# EAGLE schematic MicroBrute Noise add-on (EAGLE 7.5.0)
CNAME: Microbrute Addon; CREVISION: 1; DESIGNER: Gilberte / Mads Kjeldgaard
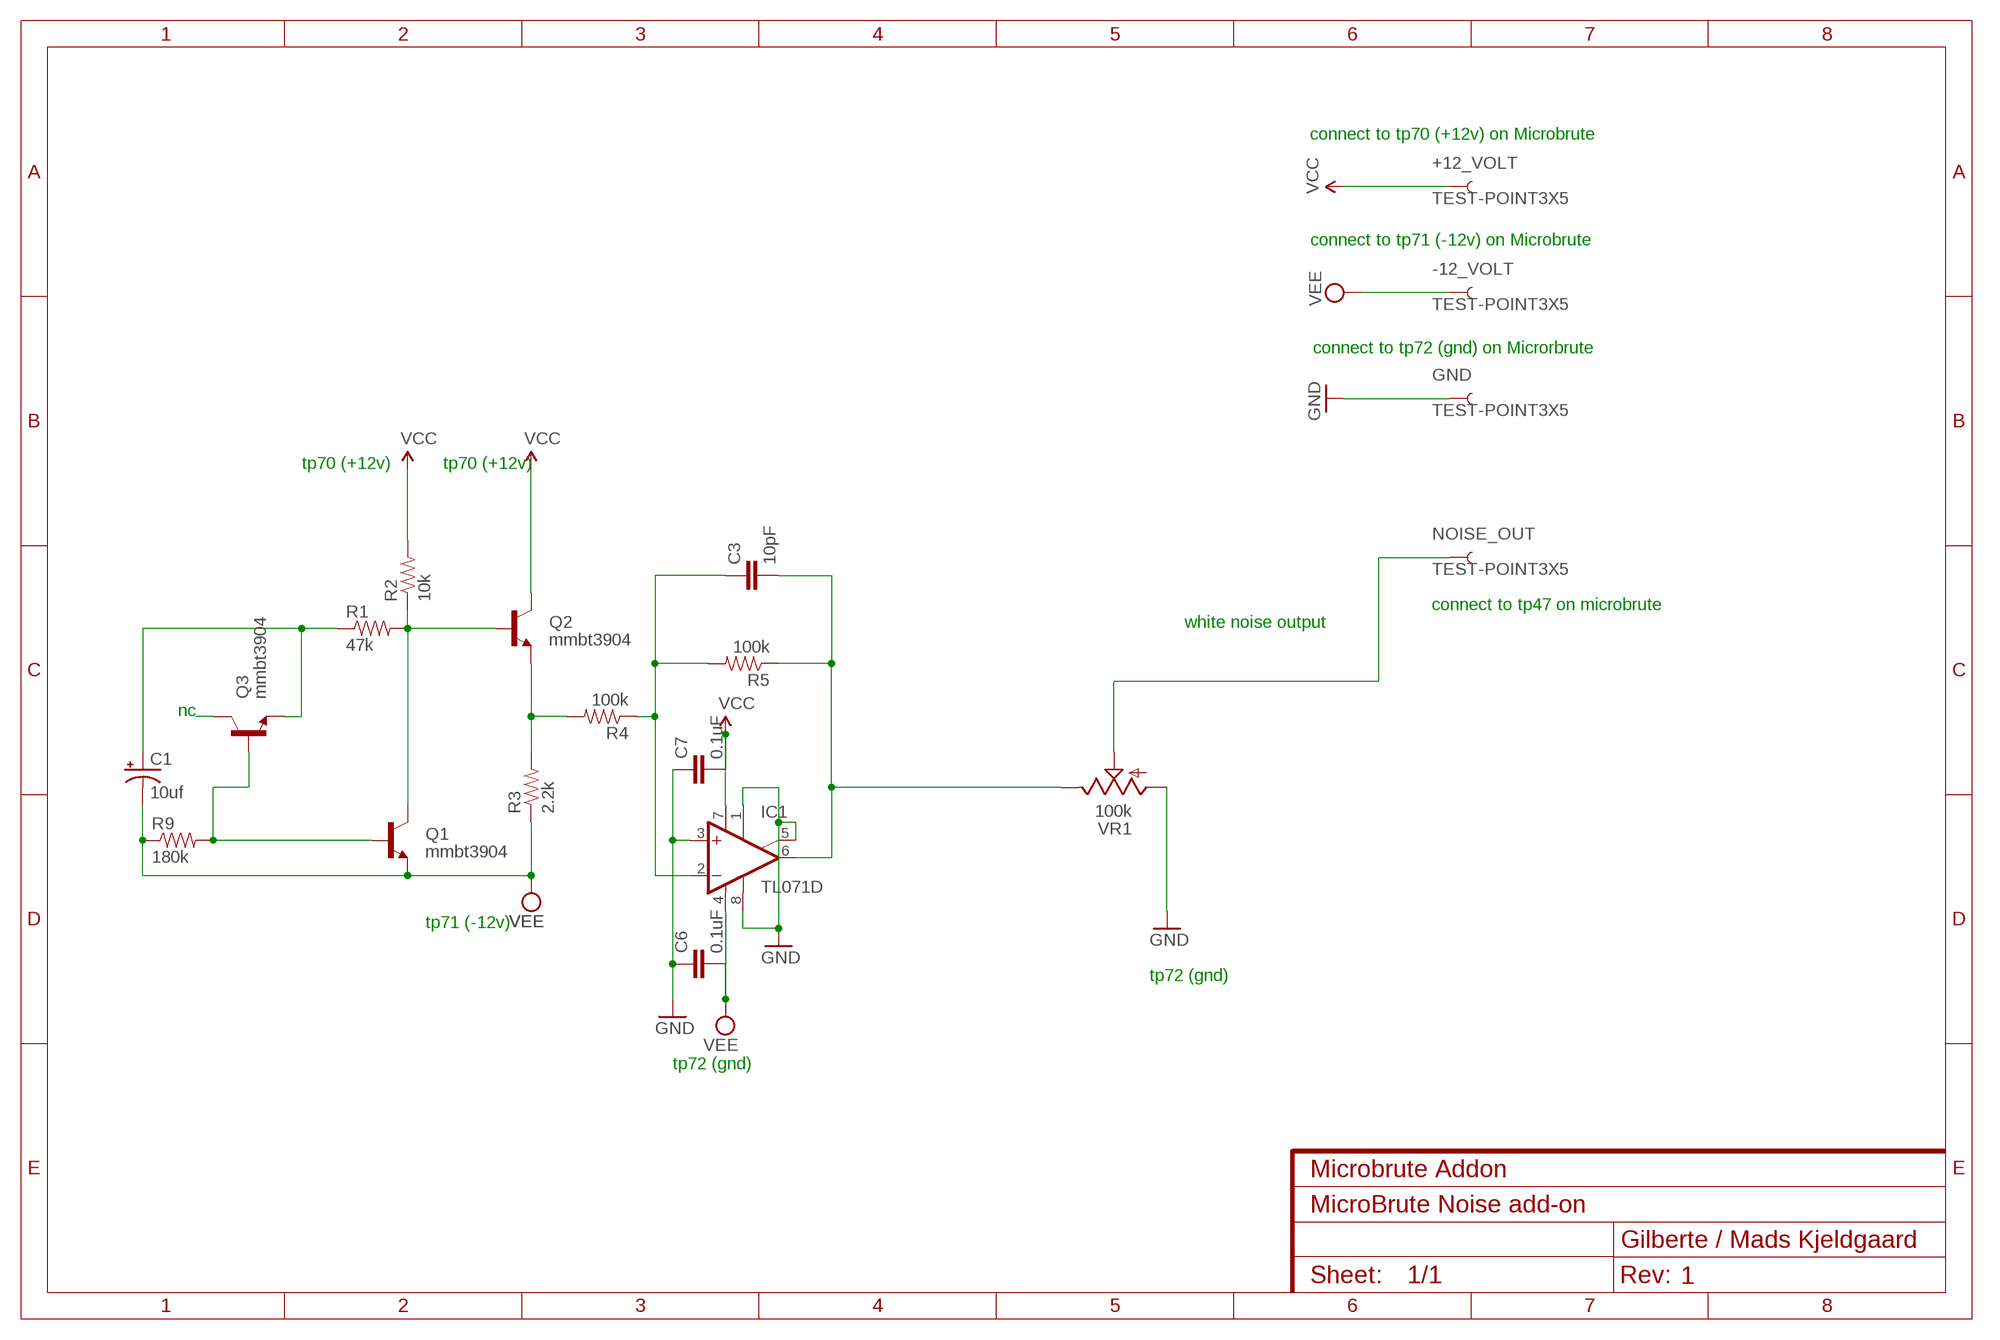
[diagram p0: schematic, sheet 1]

## Parts
+12_VOLT  TEST-POINT3X5  [PAD.03X.05]
-12_VOLT  TEST-POINT3X5  [PAD.03X.05]
C1  10uf  CAP_POLC  [PANASONIC_C]
C3  10pF  0.1UF-25V(+80/-20%)(0603)  [0603-CAP]
C6  0.1uF  0.1UF-25V(+80/-20%)(0603)  [0603-CAP]
C7  0.1uF  0.1UF-25V(+80/-20%)(0603)  [0603-CAP]
GND  TEST-POINT3X5  [PAD.03X.05]
IC1  TL071D  [SO08]
NOISE_OUT  TEST-POINT3X5  [PAD.03X.05]
Q1  mmbt3904  TRANSISTOR_NPNSOT23-3  [SOT23-3]
Q2  mmbt3904  TRANSISTOR_NPNSOT23-3  [SOT23-3]
Q3  mmbt3904  TRANSISTOR_NPNSOT23-3  [SOT23-3]
R1  47k  RESISTOR0603-RES  [0603-RES]
R2  10k  RESISTOR0603-RES  [0603-RES]
R3  2.2k  RESISTOR0603-RES  [0603-RES]
R4  100k  RESISTOR0603-RES  [0603-RES]
R5  100k  RESISTOR0603-RES  [0603-RES]
R9  180k  RESISTOR0603-RES  [0603-RES]
VR1  100k  9MM_SNAP-IN_POT_  [9MM_SNAP-IN_POT]

## Nets
GND: C6.1 C7.1 GND.P$1 IC1.1(ON1) IC1.3(+IN) IC1.5(ON2) IC1.8(OPT) VR1.1(A)
N$2: Q1.1(B) Q3.1(B) R9.2
N$3: C1.+ Q3.2(E) R1.1
N$4: Q2.2(E) R3.2 R4.2
N$5: Q3.3(C)
N$6: C3.2 IC1.6(OUT) R5.1 VR1.3(E)
N$9: C3.1 IC1.2(-IN) R4.1 R5.2
N$12: Q1.3(C) Q2.1(B) R1.2 R2.1
N$13: NOISE_OUT.P$1 VR1.2(S)
VCC: +12_VOLT.P$1 C7.2 IC1.7(V+) Q2.3(C) R2.2
VEE: -12_VOLT.P$1 C1.- C6.2 IC1.4(V-) Q1.2(E) R3.1 R9.1

## Notes on the sheet
- connect to tp70 (+12v) on Microbrute
- connect to tp71 (-12v) on Microbrute
- connect to tp72 (gnd) on Microrbrute
- tp70 (+12v) | tp70 (+12v)
- connect to tp47 on microbrute
- white noise output
- nc
- tp71 (-12v)
- tp72 (gnd)
- tp72 (gnd)

## Library data of the parts
+12_VOLT -12_VOLT GND NOISE_OUT = SparkFun-Passives:TEST-POINT: Bare copper test points for troubleshooting or ICT
C1 = SparkFun-Passives:CAP_POL: Capacitor Polarized These are standard SMD and PTH capacitors. Normally 10uF, 47uF, and 100uF in electrolytic and tantalum varieties. Always verify the external diameter of the through hole cap, it varies with capacity, voltage, and manufacturer. The EIA devices should be standard.
C3 = SparkFun-Capacitors:0.1UF-25V(+80/-20%)(0603): CAP-00810 Ceramic Standard decoupling cap; PROD_ID: CAP-00810; VALUE: 0.1uF
C6 C7 = SparkFun-Capacitors:0.1UF-25V(+80/-20%)(0603): CAP-00810 Ceramic Standard decoupling cap; PROD_ID: CAP-00810
IC1 = linear:TL071: OP AMP
Q1-Q3 = SparkFun-DiscreteSemi:TRANSISTOR_NPN: Generic NPN BJT MMBT2222A - TRANS-08049 (SOT-23, 1A 40V) MPSA42 - TRANS-09116 (SOT-23, 500mA 300V) MMBT5088LT1G - TRANS-11160 (SOT-23, 50 mA 30V) BC547 - COM-08928 <http://www.sparkfun.com/products/8928> (TO-92 45V 100mA) (1.Collector 2.Base 3.Emitter) 2N3904 - COM-00521 <http://www.sparkfun.com/products/521> (TO-92 40V 200mA) (1.Emitter 2.Base 3.Collector) P2N2222A - COM-12852 <http://www.sparkfun.com/products/12852> (TO-92 40V 600mA) (1.Collector 2.Base 3.Emitter); PROD_ID: TRANS-08049
R1-R5 R9 = SparkFun-Passives:RESISTOR: Resistor Basic schematic elements and footprints for 0603, 1206, and PTH resistors.
VR1 = MusicThingModular:9MM_SNAP-IN_POT: 9mm vertical snap-in pot, Alpha / Panasonic style